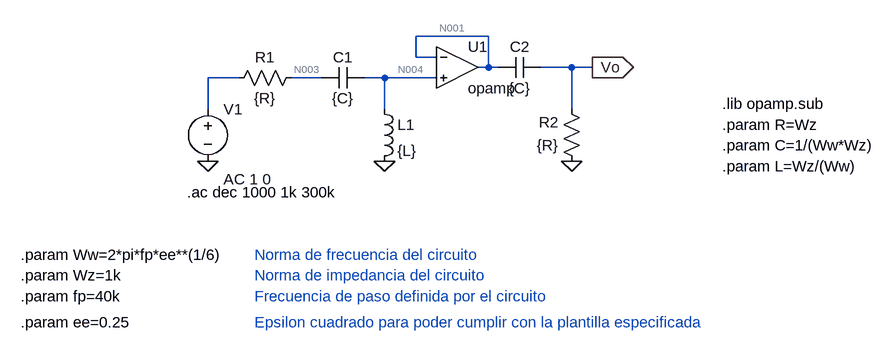
[diagram p0: schematic pasivo.asc]
pasivo.asc, the LTspice schematic file:
Version 4
SHEET 1 1072 680
WIRE 320 0 208 0
WIRE 208 32 208 0
WIRE 240 32 208 32
WIRE 320 48 320 0
WIRE 320 48 304 48
WIRE 336 48 320 48
WIRE 448 48 400 48
WIRE 480 48 448 48
WIRE -64 64 -112 64
WIRE 64 64 16 64
WIRE 160 64 128 64
WIRE 240 64 160 64
WIRE -112 112 -112 64
WIRE 160 112 160 64
WIRE 448 112 448 48
FLAG -112 192 0
FLAG 448 192 0
FLAG 160 192 0
FLAG 480 48 Vo
IOPIN 480 48 Out
SYMBOL res 32 48 R90
WINDOW 0 0 56 VBottom 2
WINDOW 3 32 56 VTop 2
SYMATTR InstName R1
SYMATTR Value {R}
SYMBOL res 464 208 R180
WINDOW 0 36 76 Left 2
WINDOW 3 36 40 Left 2
SYMATTR InstName R2
SYMATTR Value {R}
SYMBOL cap 128 48 R90
WINDOW 0 0 32 VBottom 2
WINDOW 3 32 32 VTop 2
SYMATTR InstName C1
SYMATTR Value {C}
SYMBOL cap 400 32 R90
WINDOW 0 0 32 VBottom 2
WINDOW 3 32 32 VTop 2
SYMATTR InstName C2
SYMATTR Value {C}
SYMBOL ind 144 96 R0
SYMATTR InstName L1
SYMATTR Value {L}
SYMBOL Opamps\\opamp 272 -16 R0
SYMATTR InstName U1
SYMBOL voltage -112 96 R0
WINDOW 123 24 124 Left 2
WINDOW 39 0 0 Left 2
SYMATTR Value2 AC 1 0
SYMATTR InstName V1
SYMATTR Value ""
TEXT 680 104 Left 2 !.lib opamp.sub
TEXT -144 240 Left 2 !.ac dec 1000 1k 300k
TEXT 680 168 Left 2 !.param C=1/(Ww*Wz)
TEXT 680 136 Left 2 !.param R=Wz
TEXT 680 200 Left 2 !.param L=Wz/(Ww)
TEXT -400 336 Left 2 !.param Ww=2*pi*fp*ee**(1/6)
TEXT -400 368 Left 2 !.param Wz=1k
TEXT -400 400 Left 2 !.param fp=40k
TEXT -40 336 Left 2 ;Norma de frecuencia del circuito
TEXT -40 368 Left 2 ;Norma de impedancia del circuito
TEXT -40 400 Left 2 ;Frecuencia de paso definida por el circuito
TEXT -400 440 Left 2 !.param ee=0.25
TEXT -40 440 Left 2 ;Epsilon cuadrado para poder cumplir con la plantilla especificada

The netlist it stands for:
* pasivo.asc
R1 N003 N002 {R}
R2 0 Vo {R}
C1 N004 N003 {C}
C2 Vo N001 {C}
L1 N004 0 {L}
XU1 N001 N004 N001 opamp Aol=100K GBW=10Meg  ; pins invin noninvin out
V1 N002 0 AC 1 0
.lib opamp.sub
.ac dec 1000 1k 300k
.param C=1/(Ww*Wz)
.param R=Wz
.param L=Wz/(Ww)
.param Ww=2*pi*fp*ee**(1/6)
.param Wz=1k
.param fp=40k
* Norma de frecuencia del circuito
* Norma de impedancia del circuito
* Frecuencia de paso definida por el circuito
.param ee=0.25
* Epsilon cuadrado para poder cumplir con la plantilla especificada
.backanno
.end

* Results of the author's LTspice run, read from the files saved beside the schematic
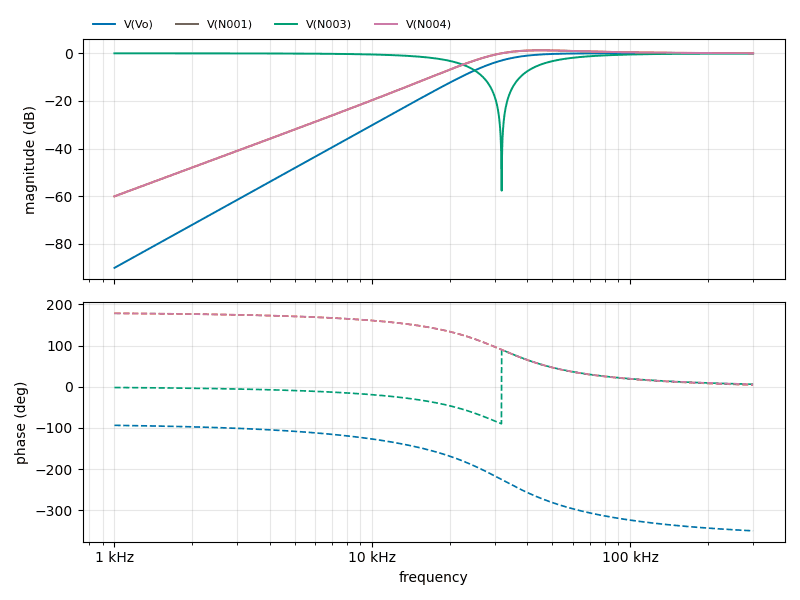
[diagram p1: AC Analysis of pasivo.asc, plotted from the saved traces]
* AC Analysis, 1 run:
*   V(Vo): -90.10 dB at 1 kHz, -0.00 dB at 300 kHz, peak -0.00 dB at 153.5 kHz, 3 dB below the peak at 31.74 kHz
*   V(N001): -60.06 dB at 1 kHz, 0.04 dB at 300 kHz, peak 1.25 dB at 44.87 kHz, 3 dB below the peak at 27.16 kHz
*   V(N003): -0.00 dB at 1 kHz, -0.05 dB at 300 kHz, peak -0.00 dB at 1 kHz, 3 dB below the peak at 19.63 kHz
*   V(N004): -60.06 dB at 1 kHz, 0.05 dB at 300 kHz, peak 1.25 dB at 44.87 kHz, 3 dB below the peak at 27.16 kHz